# EAGLE design avr_route (EAGLE 5.07)
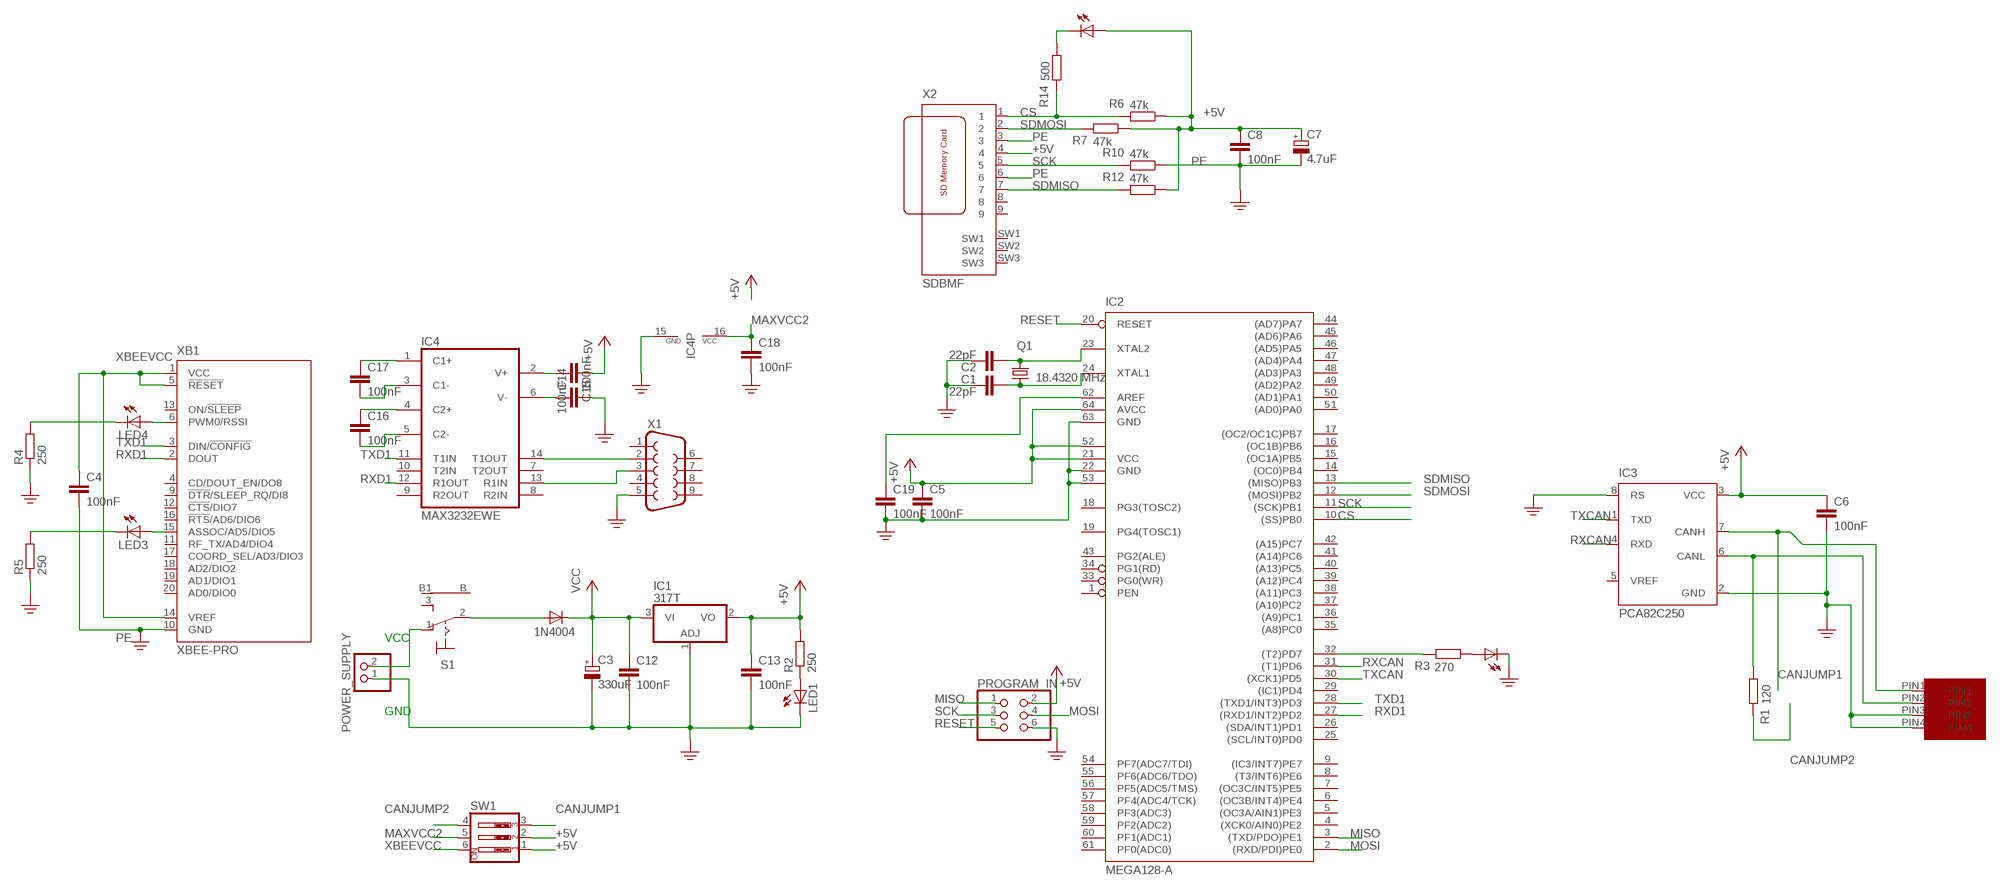
[diagram p0: schematic, sheet 1]

## Parts
C1  22pF  C5/2.5  [C5B2.5]
C2  22pF  C5/2.5  [C5B2.5]
C3  330uF  CPOL-EUE15-5AXIAL  [E15-5]
C4  100nF  C-EU050-024X044  [C050-024X044]
C5  100nF  C-EU050-024X044  [C050-024X044]
C6  100nF  C-EU050-024X044  [C050-024X044]
C7  4.7uF  CPOL-EUE15-5AXIAL  [E15-5]
C8  100nF  C-EU050-024X044  [C050-024X044]
C12  100nF  C-EU050-024X044  [C050-024X044]
C13  100nF  C-EU050-024X044  [C050-024X044]
C14  100nF  C-EU050-024X044  [C050-024X044]
C15  100nF  C-EU050-024X044  [C050-024X044]
C16  100nF  C-EU050-024X044  [C050-024X044]
C17  100nF  C-EU050-024X044  [C050-024X044]
C18  100nF  C-EU050-024X044  [C050-024X044]
C19  100nF  C-EU050-024X044  [C050-024X044]
D1  1N4004  [DO41-10]
IC1  317T  [TO220H]
IC2  MEGA128-A  [TQFP64]
IC3  PCA82C250  [DIL08]
IC4  MAX3232EWE  [SO16L]
LED1  LED5MM  [LED5MM]
LED2  LED5MM  [LED5MM]
LED3  LED5MM  [LED5MM]
LED4  LED5MM  [LED5MM]
LED5  LED5MM  [LED5MM]
POWER_SUPPLY  PINHD-1X2  [1X02]
PROGRAM_IN  PINHD-2X3  [2X03]
Q1  18.4320 MHz  CRYSTALHC49U70  [HC49U70]
R1  120  R-EU_0207/10  [0207/10]
R2  250  R-EU_0207/10  [0207/10]
R3  270  R-EU_0207/10  [0207/10]
R4  250  R-EU_0207/10  [0207/10]
R5  250  R-EU_0207/10  [0207/10]
R6  47k  R-EU_0207/10  [0207/10]
R7  47k  R-EU_0207/10  [0207/10]
R10  47k  R-EU_0207/10  [0207/10]
R12  47k  R-EU_0207/10  [0207/10]
R14  500  R-EU_0207/10  [0207/10]
S1  LPV-1  [LPV-1]
SW1  SW_DIP-3  [EDG-03]
U$1  MICROFIT4  [MICROFIT4SOCK]
X1  F09HP  [F09HP]
X2  SDBMF  [SDBMF-009XXBXX2]
XB1  XBEE-PRO  [XBEE-PRO]

## Nets
+5V: C5.1 C6.1 C7.+ C8.1 C13.1 C15.1 IC1.2(VO) IC2.21(VCC) IC2.52(VCC1) IC2.64(AVCC) IC3.3(VCC) LED5.A PROGRAM_IN.2 R2.2 R6.1 R7.1 R12.1 SW1.1 SW1.2 X2.4
CANJUMP1: IC3.7(CANH) SW1.3 U$1.PIN1
CANJUMP2: R1.2 SW1.4
CS: IC2.10((SS)PB0) R6.2 R14.2 X2.1
MAXVCC2: C18.1 IC4.16(VCC) SW1.5
MISO: IC2.3((TXD/PDO)PE1) PROGRAM_IN.1
MOSI: IC2.2((RXD/PDI)PE0) PROGRAM_IN.4
N$1: C1.2 IC2.24(XTAL1) Q1.1
N$2: C2.2 IC2.23(XTAL2) Q1.2
N$4: D1.A S1.2(P)
N$5: POWER_SUPPLY.2 S1.1(O)
N$6: LED1.A R2.1
N$8: LED2.A R3.1
N$10: C19.1 IC2.62(AREF)
N$21: IC4.13(R1IN) X1.3
N$33: IC4.14(T1OUT) X1.2
N$35: C17.1 IC4.1(C1+)
N$36: C17.2 IC4.3(C1-)
N$37: C16.1 IC4.4(C2+)
N$38: C16.2 IC4.5(C2-)
N$39: C14.1 IC4.6(V-)
N$41: C15.2 IC4.2(V+)
N$43: IC2.32((T2)PD7) R3.2
N$50: LED4.A XB1.6(PWM0/RSSI)
N$51: IC3.6(CANL) R1.1 U$1.PIN2
N$52: LED3.A XB1.15(ASSOC/AD5/DIO5)
N$57: LED4.K(C) R4.2
N$58: LED3.K(C) R5.2
N$59: LED5.K(C) R14.1
PE: C1.1 C2.1 C3.- C4.2 C5.2 C6.2 C7.- C8.2 C12.2 C13.2 C14.2 C18.2 C19.2 IC1.1(ADJ) IC2.22(GND) IC2.53(GND1) IC2.63(GND) IC3.2(GND) IC3.8(RS) IC4.15(GND) LED1.K(C) LED2.K(C) POWER_SUPPLY.1 PROGRAM_IN.6 R4.1 R5.1 R10.1 U$1.PIN3 U$1.PIN4 X1.5 X2.3 X2.6 XB1.10(GND)
RESET: IC2.20(RESET) PROGRAM_IN.5
RXCAN: IC2.31((T1)PD6) IC3.4(RXD)
RXD1: IC2.27((RXD1/INT2)PD2) IC4.12(R1OUT) XB1.2(DOUT)
SCK: IC2.11((SCK)PB1) PROGRAM_IN.3 R10.2 X2.5
SDMISO: IC2.13((MISO)PB3) R12.2 X2.7
SDMOSI: IC2.12((MOSI)PB2) R7.2 X2.2
TXCAN: IC2.30((XCK1)PD5) IC3.1(TXD)
TXD1: IC2.28((TXD1/INT3)PD3) IC4.11(T1IN) XB1.3(DIN/!CONFIG)
VCC: C3.+ C12.1 D1.C IC1.3(VI)
XBEEVCC: C4.1 SW1.6 XB1.1(VCC) XB1.5(!RESET) XB1.14(VREF)
Unconnected: IC2.1(PEN) IC2.4((XCK0/AIN0)PE2) IC2.5((OC3A/AIN1)PE3) IC2.6((OC3B/INT4)PE4) IC2.7((OC3C/INT5)PE5) IC2.8((T3/INT6)PE6) IC2.9((IC3/INT7)PE7) IC2.14((OC0)PB4) IC2.15((OC1A)PB5) IC2.16((OC1B)PB6) IC2.17((OC2/OC1C)PB7) IC2.18(PG3(TOSC2)) IC2.19(PG4(TOSC1)) IC2.25((SCL/INT0)PD0) IC2.26((SDA/INT1)PD1) IC2.29((IC1)PD4) IC2.33(PG0(WR)) IC2.34(PG1(RD)) IC2.35((A8)PC0) IC2.36((A9)PC1) IC2.37((A10)PC2) IC2.38((A11)PC3) IC2.39((A12)PC4) IC2.40((A13)PC5) IC2.41((A14)PC6) IC2.42((A15)PC7) IC2.43(PG2(ALE)) IC2.44((AD7)PA7) IC2.45((AD6)PA6) IC2.46((AD5)PA5) IC2.47((AD4)PA4) IC2.48((AD3)PA3) IC2.49((AD2)PA2) IC2.50((AD1)PA1) IC2.51((AD0)PA0) IC2.54(PF7(ADC7/TDI)) IC2.55(PF6(ADC6/TDO)) IC2.56(PF5(ADC5/TMS)) IC2.57(PF4(ADC4/TCK)) IC2.58(PF3(ADC3)) IC2.59(PF2(ADC2)) IC2.60(PF1(ADC1)) IC2.61(PF0(ADC0)) IC3.5(VREF) IC4.7(T2OUT) IC4.8(R2IN) IC4.9(R2OUT) IC4.10(T2IN) S1.3(S) S1.B S1.B1 X1.1 X1.4 X1.6 X1.7 X1.8 X1.9 X2.8 X2.9 X2.SW1 X2.SW2 X2.SW3 XB1.4(CD/DOUT_EN/DO8) XB1.9(!DTR!/SLEEP_RQ/DI8) XB1.11(RF_TX/AD4/DIO4) XB1.12(!CTS!/DIO7) XB1.13(ON/!SLEEP) XB1.16(!RTS!/AD6/DIO6) XB1.17(COORD_SEL/AD3/DIO3) XB1.18(AD2/DIO2) XB1.19(AD1/DIO1) XB1.20(AD0/DIO0)

## Notes on the sheet
- VCC
- GND

## Library data of the parts
C1 C2 = capacitor-wima:C: CAPACITOR naming: grid - package width
C3 C7 = rcl:CPOL-EU: POLARIZED CAPACITOR, European symbol
C4-C6 C8 C12-C19 = rcl:C-EU: CAPACITOR, European symbol
D1 = diode:1N4004: DIODE general purpose rectifier, 1 A
IC1 = linear:*317: Positive VOLTAGE REGULATOR
IC2 = atmel:MEGA128: MICROCONTROLLER 128 Kbytes FLASH 4 Kbytes SRAM 4 Kbytes EEPROM DUAL USART 8-channel 10 bit ADC Source: avr.lbr
IC3 = micro-philips:PCA82C250: CAN CONTROLLER INTERFACE
IC4 = maxim:MAX3232*: True RS-232 Transceivers 3.0V to 5.5V, Low-Power up to 1Mbps, Using Four 0.1µF External Capacitors Source: http://pdfserv.maxim-ic.com/en/ds/MAX3222-MAX3241.pdf
LED1-LED5 = led:LED: LED OSRAM: - CHIPLED LG R971, LG N971, LY N971, LG Q971, LY Q971, LO R971, LY R971 LH N974, LH R974 LS Q976, LO Q976, LY Q976 LO Q996 - Hyper CHIPLED LW Q18S LB Q993, LB Q99A, LB R99A - SideLED LS A670, LO A670, LY A670, LG A670, LP A670 LB A673, LV A673, LT A673, LW A673 LH A674 LY A675 LS A676, LA A676, LO A676, LY A676, LW A676 LS A679, LY A679, LG A679 - Hyper Micro SIDELED® LS Y876, LA Y876, LO Y876, LY Y876 LT Y87S - SmartLED LW L88C, LW L88S LB L89C, LB L89S, LG L890 LS L89K, LO L89K, LY L89K LS L896, LA L896, LO L896, LY L896 - TOPLED LS T670, LO T670, LY T670, LG T670, LP T670 LSG T670, LSP T670, LSY T670, LOP T670, LYG T670 LG T671, LOG T671, LSG T671 LB T673, LV T673, LT T673, LW T673 LH T674 LS T676, LA T676, LO T676, LY T676, LB T676, LH T676, LSB T676, LW T676 LB T67C, LV T67C, LT T67C, LS T67K, LO T67K, LY T67K, LW E67C LS E67B, LA E67B, LO E67B, LY E67B, LB E67C, LV E67C, LT E67C LW T67C LS T679, LY T679, LG T679 LS T770, LO T770, LY T770, LG T770, LP T770 LB T773, LV T773, LT T773, LW T773 LH T774 LS E675, LA E675, LY E675, LS T675 LS T776, LA T776, LO T776, LY T776, LB T776 LHGB T686 LT T68C, LB T68C - Hyper Mini TOPLED® LB M676 - Mini TOPLED Santana® LG M470 LS M47K, LO M47K, LY M47K Source: http://www.osram.convergy.de LUXEON: - LUMILED® LXK2-PW12-R00, LXK2-PW12-S00, LXK2-PW14-U00, LXK2-PW14-V00 LXK2-PM12-R00, LXK2-PM12-S00, LXK2-PM14-U00 LXK2-PE12-Q00, LXK2-PE12-R00, LXK2-PE12-S00, LXK2-PE14-T00, LXK2-PE14-U00 LXK2-PB12-K00, LXK2-PB12-L00, LXK2-PB12-M00, LXK2-PB14-N00, LXK2-PB14-P00, LXK2-PB14-Q00 LXK2-PR12-L00, LXK2-PR12-M00, LXK2-PR14-Q00, LXK2-PR14-R00 LXK2-PD12-Q00, LXK2-PD12-R00, LXK2-PD12-S00 LXK2-PH12-R00, LXK2-PH12-S00 LXK2-PL12-P00, LXK2-PL12-Q00, LXK2-PL12-R00 Source: www.luxeon.com KINGBRIGHT: KA-3528ASYC Source: www.kingbright.com
POWER_SUPPLY = pinhead:PINHD-1X2: PIN HEADER
PROGRAM_IN = pinhead:PINHD-2X3: PIN HEADER
Q1 = crystal:CRYSTAL: CRYSTAL
R1-R7 R10 R12 R14 = resistor:R-EU_: RESISTOR, European symbol
S1 = switch:LPV-1: TOGGLE SWITCH
SW1 = special:SW_DIP-3: DIP SWITCH
U$1 = UNICORN:MICROFIT4
X1 = con-subd:F09: SUB-D
X2 = farnell:SDBMF: SD MEMORY CARD PUSH-PUSH WITH CONNECTOR TYPE B (BIG SWUÌTCH #3) KINGFONT PRECISION INDUSTIAL CO., LTD Source: http://www.farnell.com/datasheets/74273.pdf Best.-Nr.: 9186174 Hersteller: MULTICOMP Herstellerbez.: SDBMF-00915B0T2
XB1 = maxstream:XBEE: XBee (TM) /XBee-PRO(TM) OEM RF Modules Source: MaxStream, Inc. xbee_productmanual.pdf

## Board
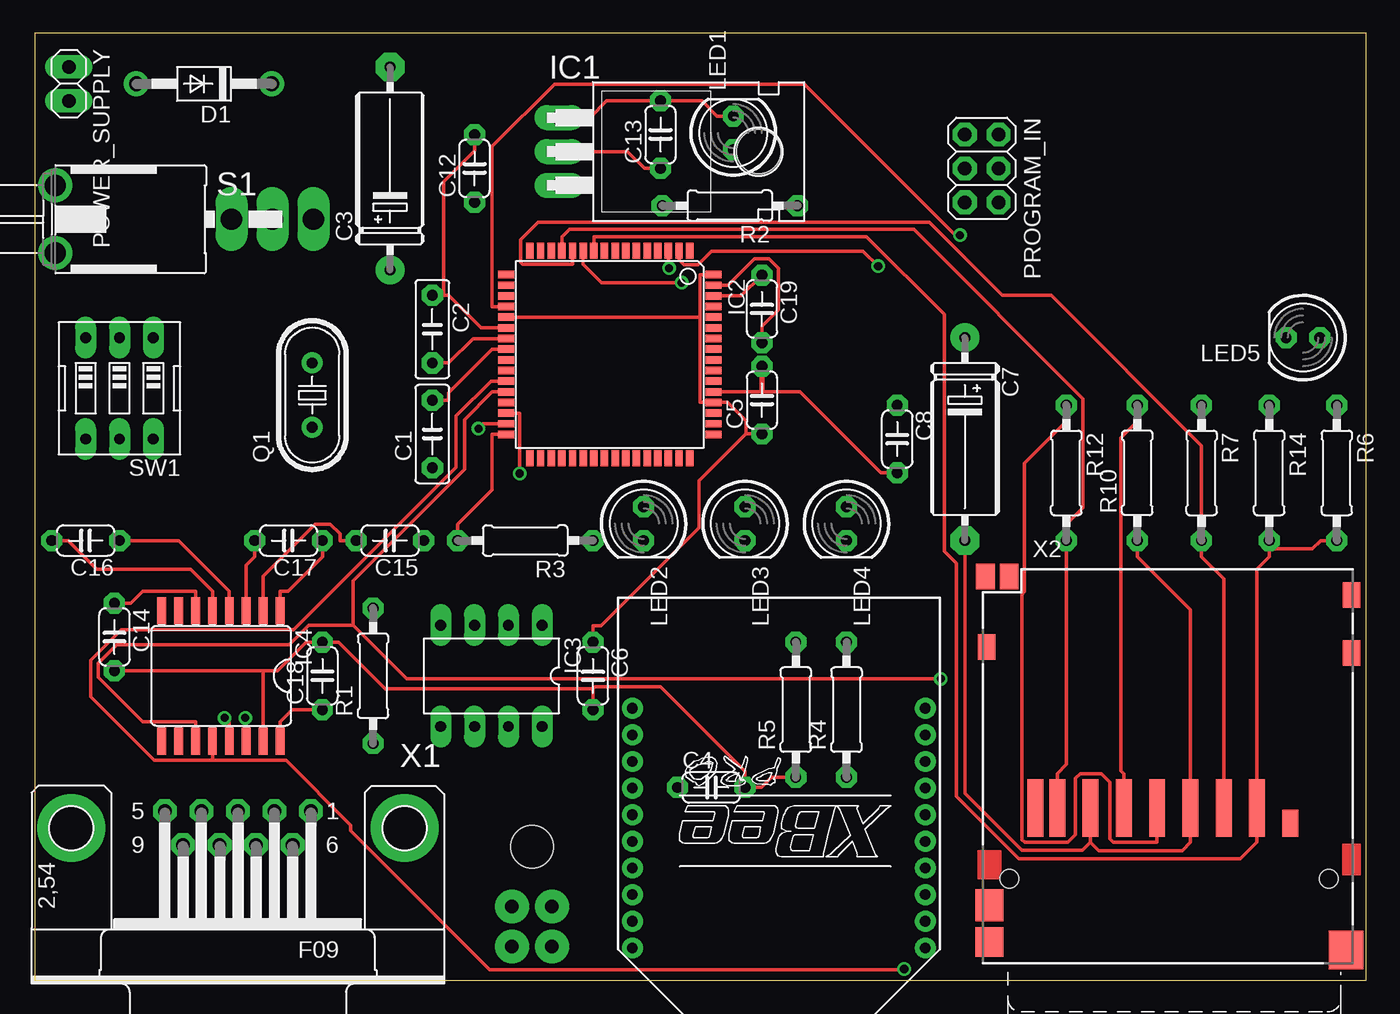
[diagram p1: board, top side]
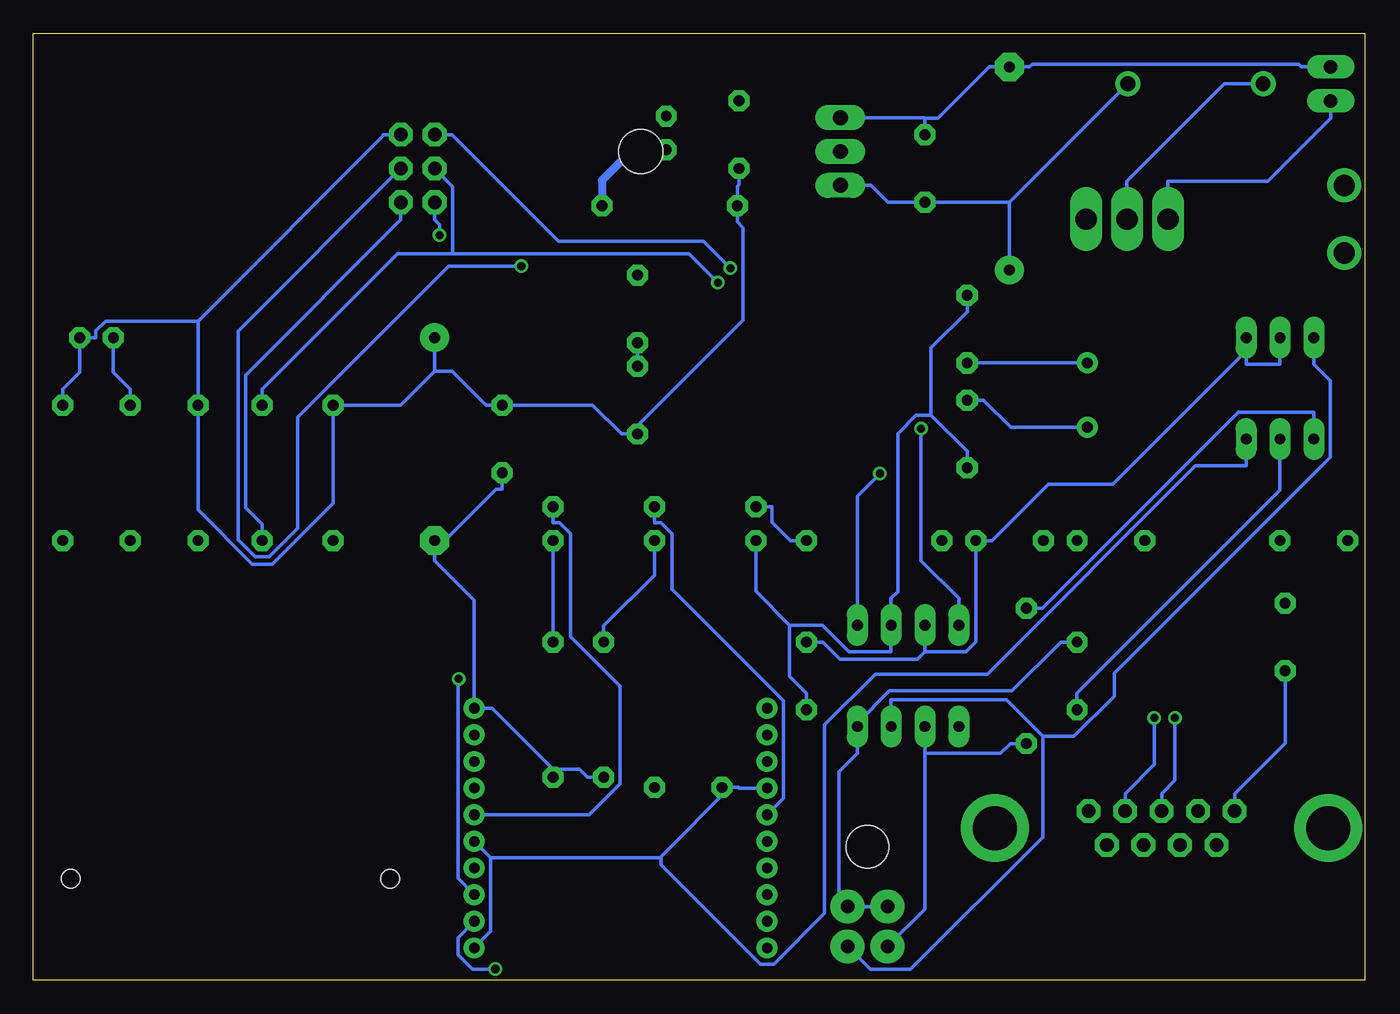
[diagram p2: board, bottom side, seen from below]

Size 100 x 71.11 mm. Coordinates in mm from the lower left corner, seen from the top.
Outline: 0,0 100,0 100,71.11 0,71.11 0,0
Copper layers (1*16): Top 0.035mm / dielectric 1.5mm / Bottom 0.035mm
Design rules "default *": minimum track width 10mil, minimum drill 24mil, track to track 12mil, track to pad 12mil, pad to pad 8mil, via to via 12mil, smd to smd 8mil, copper to edge 40mil, drill to drill 8mil, minimum pad ring 15mil, minimum via ring 8mil, stop-mask expansion 4mil, vias tented up to drill 0mil, thermal gap 10mil
tRestrict: area 43.2,1.3 to 45.7,21.6; area 66,1.3 to 68.6,21.6; area 29.2,25.4 to 39.4,27.9; area 29.2,17.8 to 39.4,20.3; area 35.4,1.9 to 39.2,7; area 34.3,1.3 to 40.6,6.3; area 2.5,47 to 10.2,49.5; area 2.5,39.4 to 10.2,41.9; area 59.7,31.8 to 62.2,36.8; area 52.1,31.8 to 54.6,35.6; area 52.1,35.6 to 54.6,36.8; area 92.7,47 to 97.8,49.5; 9 more areas

### Footprints (pad centres in the part's own frame; a part is rotated, then mirrored left to right if it is on the bottom)
C5B2.5 = drill 0.813 pad 1.6 octagon: 1 -2.54,0; 2 2.54,0
E15-5 = drill 0.813 pad 2.159 round: + -7.62,0 | drill 0.813 pad 2.159 octagon: - 7.62,0
C050-024X044 = drill 0.813 octagon: 1 -2.54,0; 2 2.54,0
DO41-10 = drill 1.118 round: A 5.08,0; C -5.08,0
TO220H = drill 1.118 long: 1 -2.54,-10.16; 2 0,-10.16; 3 2.54,-10.16 | hole 3.302: 0,4.826
TQFP64 = smd 1.194 x 0.559: 1 -7.8,6; 2 -7.8,5.2; 3 -7.8,4.4; 4 -7.8,3.6; 5 -7.8,2.8; 6 -7.8,2; 7 -7.8,1.2; 8 -7.8,0.4; 9 -7.8,-0.4; 10 -7.8,-1.2; 11 -7.8,-2; 12 -7.8,-2.8; 13 -7.8,-3.6; 14 -7.8,-4.4; 15 -7.8,-5.2; 16 -7.8,-6; 33 7.8,-6; 34 7.8,-5.2; 35 7.8,-4.4; 36 7.8,-3.6; 37 7.8,-2.8; 38 7.8,-2; 39 7.8,-1.2; 40 7.8,-0.4; 41 7.8,0.4; 42 7.8,1.2; 43 7.8,2; 44 7.8,2.8; 45 7.8,3.6; 46 7.8,4.4; 47 7.8,5.2; 48 7.8,6 | smd 0.559 x 1.194: 17 -6,-7.8; 18 -5.2,-7.8; 19 -4.4,-7.8; 20 -3.6,-7.8; 21 -2.8,-7.8; 22 -2,-7.8; 23 -1.2,-7.8; 24 -0.4,-7.8; 25 0.4,-7.8; 26 1.2,-7.8; 27 2,-7.8; 28 2.8,-7.8; 29 3.6,-7.8; 30 4.4,-7.8; 31 5.2,-7.8; 32 6,-7.8; 49 6,7.8; 50 5.2,7.8; 51 4.4,7.8; 52 3.6,7.8; 53 2.8,7.8; 54 2,7.8; 55 1.2,7.8; 56 0.4,7.8; 57 -0.4,7.8; 58 -1.2,7.8; 59 -2,7.8; 60 -2.8,7.8; 61 -3.6,7.8; 62 -4.4,7.8; 63 -5.2,7.8; 64 -6,7.8
DIL08 = drill 0.813 long: 1 -3.81,-3.81; 2 -1.27,-3.81; 3 1.27,-3.81; 4 3.81,-3.81; 5 3.81,3.81; 6 1.27,3.81; 7 -1.27,3.81; 8 -3.81,3.81
SO16L = smd 0.66 x 2.032: 1 -4.445,-4.902; 2 -3.175,-4.902; 3 -1.905,-4.902; 4 -0.635,-4.902; 5 0.635,-4.902; 6 1.905,-4.902; 7 3.175,-4.902; 8 4.445,-4.902; 9 4.445,4.902; 10 3.175,4.902; 11 1.905,4.902; 12 0.635,4.902; 13 -0.635,4.902; 14 -1.905,4.902; 15 -3.175,4.902; 16 -4.445,4.902
LED5MM = drill 0.813 octagon: A -1.27,0; K 1.27,0
1X02 = drill 1.016 long: 1 -1.27,0; 2 1.27,0
2X03 = drill 1.016 octagon: 1 -2.54,-1.27; 2 -2.54,1.27; 3 0,-1.27; 4 0,1.27; 5 2.54,-1.27; 6 2.54,1.27
HC49U70 = drill 0.813 round: 1 -2.413,0; 2 2.413,0
0207/10 = drill 0.813 octagon: 1 -5.08,0; 2 5.08,0
LPV-1 = drill 1.6 long: 1 0,13.24; 2 0,16.32; 3 0,19.4 | drill 1.6 pad 2.54 round: B -2.54,0; B1 2.54,0
EDG-03 = drill 0.813 long: 1 -2.54,-3.81; 2 0,-3.81; 3 2.54,-3.81; 4 2.54,3.81; 5 0,3.81; 6 -2.54,3.81
MICROFIT4SOCK = drill 1 pad 2.54 round: PIN1 -2,0; PIN2 1,0; PIN3 -2,-3; PIN4 1,-3 | hole 3.2: -0.5,-7.5
F09HP = drill 1.016 octagon: 1 -5.486,-1.27; 2 -2.743,-1.27; 3 0,-1.27; 4 2.743,-1.27; 5 5.486,-1.27; 6 -4.115,1.27; 7 -1.372,1.27; 8 1.372,1.27; 9 4.115,1.27 | drill 3.302 pad 5.08 round: G1 -12.522,0; G2 12.522,0
SDBMF-009XXBXX2 = smd 1.2 x 4.3: 1 6.7,5.325; 2 4.2,5.325; 3 1.7,5.325; 4 -0.8,5.325; 5 -3.3,5.325; 6 -5.8,5.325; 7 -8.3,5.325; 8 -9.925,5.325 | smd 1.2 x 2: 9 9.2,4.175 | smd 2.1 x 2.4: M1 -13.4,-2 | smd 2.6 x 2.9: M2 13.4,-5.35 | smd 1.3 x 1.9: M3 -13.6,17.4; M4 13.8,16.95; M5 13.8,21.3 | smd 1.4 x 1.95: SW1 -11.9,22.7; SW3 -13.7,22.7 | smd 2.1 x 2.2: SW2 -13.4,-4.75 | hole 1.4: -11.9,0; 12.1,0
XBEE-PRO = drill 0.8 pad 1.27 round: 1 -11,9; 2 -11,7; 3 -11,5; 4 -11,3; 5 -11,1; 6 -11,-1; 7 -11,-3; 8 -11,-5; 9 -11,-7; 10 -11,-9; 11 11,-9; 12 11,-7; 13 11,-5; 14 11,-3; 15 11,-1; 16 11,1; 17 11,3; 18 11,5; 19 11,7; 20 11,9

### Placement (x,y rotation side)
C1  29.84,41.02 90 top
C2  29.84,48.9 270 top
C3  26.67,60.96 90 top
C4  50.8,14.48 0 top
C5  54.61,43.56 90 top
C6  41.91,22.86 270 top
C7  69.85,40.64 270 top
C8  64.77,40.64 270 top
C12  33.02,60.96 90 top
C13  46.99,63.5 90 top
C14  5.97,25.78 270 top
C15  26.67,33.02 180 top
C16  3.81,33.02 180 top
C17  19.05,33.02 180 top
C18  21.59,22.86 90 top
C19  54.61,50.42 270 top
D1  12.7,67.31 180 top
IC1  49.53,62.23 270 top
IC2  43.18,46.99 270 top
IC3  34.29,22.86 180 top
IC4  13.97,22.86 180 top
LED1  52.45,63.63 90 top
LED2  45.72,34.29 270 top
LED3  53.34,34.29 270 top
LED4  60.96,34.29 270 top
LED5  95.25,48.26 180 top
POWER_SUPPLY  2.54,67.31 270 top
PROGRAM_IN  71.12,60.96 270 top
Q1  20.83,43.94 90 top
R1  25.4,22.86 90 top
R2  52.2,58.17 180 top
R3  36.83,33.02 180 top
R4  60.96,20.32 90 top
R5  57.15,20.32 90 top
R6  97.79,38.1 270 top
R7  87.63,38.1 270 top
R10  82.8,38.1 90 top
R12  77.47,38.1 270 top
R14  92.71,38.1 270 top
S1  1.52,57.15 270 top
SW1  6.35,44.45 180 top
U$1  36.83,2.54 180 top
X1  15.24,11.43 180 top
X2  85.09,7.62 0 top
XB1  55.88,11.43 180 top

### Tracks (layer width: path | path; a pad name or v marks a point on that pad's centre or on a via)
+5V
  Top 0.254: R12.1 77.47,41.96 74.34,38.83 74.34,29.17 74.13,28.96 74.13,10.56 74.35,10.35 77.58,10.35 78.15,10.92 78.15,15.17 78.51,15.53 80.1,15.53 80.76,14.87 80.76,10.62 81.01,10.36 84.29,10.36 X2.4 | C6.1 41.91,26.62 42.52,26.62 49.89,33.99 49.89,37.52 53.39,41.02 | 53.39,41.02 C5.1 | 53.39,41.02 53.39,42.01 52.01,43.39 IC2.52 49.95,43.39 49.95,49.79 | C13.1 45.77,60.96 44.5,62.23 IC1.2 | 49.95,49.79 49.95,52.99 IC2.64 | 49.95,49.79 IC2.21
  Bottom 0.254: 55.22,41.02 46.69,49.55 46.69,56.52 47.12,56.95 R2.2 47.12,59.61 46.99,59.74 C13.1 | 33.02,24.66 33.58,24.1 39.4,24.1 40.69,25.4 C6.1 | PROGRAM_IN.2 73.71,63.5 73.71,63.41 87.63,49.49 | 87.63,49.49 R7.1 87.63,35.32 83.55,31.24 82.07,31.24 77.47,35.84 R12.1 72.39,43.18 69.85,45.72 | 87.63,49.49 94.58,49.49 95.3,48.77 95.3,48.26 LED5.A 96.52,45.67 97.79,44.4 R6.1 | 69.85,45.72 68.53,45.72 65.99,43.18 C8.1 57.99,43.18 55.83,41.02 55.22,41.02 | 69.85,45.72 C7.+ | C5.1 55.22,41.02 | 33.02,24.66 29.95,24.66 29.21,25.4 C15.1 27.99,33.02 23.76,37.25 18.9,37.25 8.89,47.26 | 33.02,24.66 33.02,24.8 IC3.3 | 8.89,47.26 8.89,46.25 6.35,46.25 SW1.2 | 8.89,47.26 SW1.1
CANJUMP1
  Bottom 0.254: SW1.3 3.81,46.25 2.59,45.03 2.59,39.27 18.8,23.05 18.8,21.35 21.83,18.32 24.18,18.32 | 24.18,18.32 26.91,21.06 35.56,21.06 IC3.7 | U$1.PIN1 37.12,0.83 34.11,0.83 24.18,10.76 24.18,18.32
CANJUMP2
  Bottom 0.254: R1.2 24.18,27.94 9.47,42.65 3.81,42.65 SW1.4
CS
  Top 0.254: IC2.10 41.98,55.82 62.47,55.82 68.3,49.99 68.3,32.22 69.22,31.31 69.22,13.81 73.9,9.12 90.55,9.12 91.79,10.36 X2.1 91.79,30.88 92.71,31.8 92.71,32.41 | R6.2 96.57,33.02 95.96,32.41 92.71,32.41 | 92.71,32.41 R14.2
MAXVCC2
  Top 0.254: IC4.16 18.41,19.41 19.33,20.32 20.37,20.32 C18.1
  Bottom 0.254: C18.1 21.59,21.54 6.35,36.78 SW1.5
MISO  (via drill 0.61 pad 1.02)
  Top 0.254: IC2.3 47.58,53.52 v47.63,53.47
  Bottom 0.254: v47.63,53.47 49.66,55.51 60.53,55.51 68.53,63.5 PROGRAM_IN.1
MOSI  (via drill 0.61 pad 1.02)
  Top 0.254: v63.34,53.62 62.21,54.75 50.82,54.75 49.8,53.73 48.75,53.73 48.38,54.1 IC2.2
  Bottom 0.254: PROGRAM_IN.4 84.62,48.73 84.62,33.09 83.32,31.8 82.3,31.8 80.14,33.96 80.14,42.28 68.79,53.62 v63.34,53.62
N$1
  Top 0.254: IC2.24 34.35,47.39 31.08,44.12 31.08,43.56 C1.2
  Bottom 0.254: C1.2 28.61,43.56 26.58,41.53 Q1.1
N$2
  Top 0.254: C2.2 31.08,46.35 32.91,48.19 IC2.23
  Bottom 0.254: Q1.2 C2.2
N$4
  Bottom 0.254: S1.2 17.84,59.98 10.52,67.31 D1.A
N$5
  Bottom 0.254: POWER_SUPPLY.2 2.54,64.72 7.28,59.98 14.76,59.98 S1.1
N$6
  Bottom 0.61: LED1.A 54.99,62.36 57.28,60.07 R2.1
N$8
  Bottom 0.254: LED2.A 44.5,35.56 44.5,34.39 43.13,33.02 R3.1
N$10
  Top 0.254: C19.1 53.04,51.39 IC2.62
N$21  (via drill 0.61 pad 1.02)
  Top 0.254: IC4.13 14.61,19.41 14.53,19.41 v14.24,19.7
  Bottom 0.254: X1.3 15.24,14.02 14.24,15.02 v14.24,19.7
N$33  (via drill 0.61 pad 1.02)
  Top 0.254: IC4.14 15.88,19.62 v15.79,19.7
  Bottom 0.254: v15.79,19.7 15.79,16.21 17.98,14.02 X1.2
N$35
  Top 0.254: IC4.1 18.41,29.21 19,29.21 21.59,31.8 C17.1
N$36
  Top 0.254: C17.2 16.51,31.8 15.88,31.17 IC4.3
N$37
  Top 0.254: IC4.4 14.61,29.21 10.79,33.02 C16.1
N$38
  Top 0.254: C16.2 2.49,33.02 4.65,30.86 11.68,30.86 13.34,29.21 IC4.5
N$39
  Top 0.254: C14.1 7.19,28.32 8.08,29.21 12.06,29.21 IC4.6
N$41
  Top 0.254: C15.2 22.91,33.02 22.91,33.52 22.19,34.25 21.04,34.25 17.14,30.36 IC4.2
N$43
  Top 0.254: IC2.32 34.35,40.99 34.35,36.84 31.75,34.24 R3.2
N$50
  Bottom 0.254: LED4.A 60.96,34.34 60.45,34.34 59.64,33.52 59.64,25.8 55.92,22.09 55.92,14.74 58.24,12.43 XB1.6
N$51
  Bottom 0.254: U$1.PIN2 33.02,5.35 33.02,17.04 | R1.1 26.62,17.78 27.36,17.04 33.02,17.04 | 33.02,17.04 IC3.6
N$52
  Bottom 0.254: LED3.A 53.34,34.34 52.84,34.34 52.02,33.52 52.02,29.34 43.66,20.98 43.66,13.65 XB1.15
N$57
  Bottom 0.254: R4.2 LED4.K
N$58
  Bottom 0.254: R5.2 57.15,26.62 53.34,30.43 LED3.K
N$59
  Bottom 0.254: R14.1 92.71,44.4 93.98,45.67 LED5.K
PE
  Top 0.254: 41.91,21.89 26.32,21.89 22.81,25.4 C18.2 20.37,25.4 18.21,23.24 17.14,23.24 | 41.91,21.89 42.06,22.04 47,22.04 53.34,15.7 C4.2 54.56,14.48 55.32,15.24 R5.1 | 41.91,21.89 41.91,21.54 C6.2 | C14.2 17.14,23.24 | 17.14,23.24 17.14,19.41 IC4.15 | C12.2 33.02,62.28 30.7,59.96 30.7,51.44 | 30.7,51.44 31.08,51.44 33.52,48.99 IC2.22 | C2.1 30.7,51.44 | LED1.K 51.23,64.9 50.09,66.04 C13.2 42.95,66.04 41.68,64.77 IC1.1 | 79.29,10.36 79.91,9.74 86.17,9.74 86.79,10.36 X2.3 86.79,27.82 82.8,31.8 R10.1 | C7.- 69.85,14.03 74.13,9.76 78.68,9.76 79.29,10.36 | 79.29,10.36 X2.6 | C19.2 54.61,49.1 55.86,50.35 55.86,53.46 55.12,54.2 54.06,54.2 52.05,52.19 IC2.63 | IC2.53 54.61,44.19 57.46,44.19 63.55,38.1 C8.2
  Top 0.406: 54.61,44.19 54.61,44.81 C5.2
  Bottom 0.254: C18.2 22.81,25.4 26.48,21.73 35.69,21.73 38.1,19.32 IC3.8 38.1,17.04 39.48,15.66 39.48,6.19 U$1.PIN3 U$1.PIN4 | 43.19,26.67 45.72,29.2 45.72,31.8 LED2.K | 43.19,26.67 40.73,26.67 38.72,24.66 35.56,24.66 IC3.2 35.56,28.68 35.05,29.18 35.05,41.05 33.68,42.43 32.56,42.43 | 43.19,26.67 43.19,22.82 41.91,21.54 C6.2 | 32.56,42.43 29.84,39.71 C1.1 | 32.56,42.43 32.56,47.49 29.84,50.2 C2.1 | 60.96,15.85 65.54,20.43 XB1.10 66.88,28.54 69.85,31.51 69.85,32.26 | R5.1 58.37,15.24 58.98,15.85 60.96,15.85 | 60.96,15.85 R4.1 | C8.2 64.77,36.88 65.23,36.88 69.85,32.26 | 69.85,32.26 C7.- | C5.2 C19.2 | IC1.1 33.07,64.77 33.02,64.72 | C12.2 33.02,64.72 | 33.02,64.72 32.04,64.72 28.18,68.58 C3.- 25.16,68.58 24.96,68.77 4.94,68.77 4.75,68.58 POWER_SUPPLY.1 | PROGRAM_IN.6 72.39,57.1 84.06,45.43 84.06,35.49 82.8,34.24 R10.1 | X1.5 9.75,14.02 5.97,17.8 C14.2
RESET  (via drill 0.61 pad 1.02)
  Top 0.254: IC2.20 34.35,50.59 34.35,62.63 39.02,67.3 57.78,67.3 69.12,55.96 v69.49,55.96
  Bottom 0.254: PROGRAM_IN.5 69.85,57.1 69.49,56.74 v69.49,55.96
RXCAN  (via drill 0.61 pad 1.02)
  Top 0.254: v33.31,41.42 33.68,41.79 IC2.31
  Bottom 0.254: IC3.4 30.48,28.68 33.31,31.51 v33.31,41.42
RXD1  (via drill 0.61 pad 1.02)
  Top 0.254: 13.34,16.51 8.95,16.51 4.17,21.29 4.17,24.02 6.47,26.31 19.43,26.31 31.64,38.52 31.64,42.38 34.25,44.99 IC2.27 | v65.3,0.84 65.25,0.8 34.14,0.8 23.71,11.22 23.71,11.66 18.86,16.51 13.34,16.51 | 13.34,16.51 IC4.12
  Bottom 0.254: XB1.2 68.1,3.21 68.1,1.93 67.02,0.84 v65.3,0.84
SCK  (via drill 0.61 pad 1.02)
  Top 0.254: v48.58,52.38 42.56,52.38 41.18,53.76 IC2.11 | R10.2 82.8,41.96 81.58,40.74 81.58,15.73 81.79,15.53 X2.5
  Bottom 0.254: 68.49,54.56 50.76,54.56 v48.58,52.38 | 68.49,54.56 72.64,54.56 82.8,44.4 R10.2 | 68.49,54.56 68.49,59.6 PROGRAM_IN.3
SDMISO
  Top 0.254: X2.7 76.79,15.53 77.47,16.21 R12.2 77.47,34.24 78.72,35.49 78.72,43.67 66.02,56.38 40.14,56.38 39.58,55.82 IC2.13
SDMOSI
  Top 0.254: X2.2 89.29,30.14 87.63,31.8 R7.2 87.63,40.15 76.34,51.44 72.68,51.44 67.19,56.94 37.8,56.94 36.47,55.6 36.47,53.93 36.63,53.76 40.38,53.76 IC2.12
TXCAN  (via drill 0.61 pad 1.02)
  Top 0.254: v36.41,38.05 36.41,42.59 IC2.30
  Bottom 0.254: v36.41,38.05 38.1,36.36 38.1,28.68 IC3.1
TXD1  (via drill 0.61 pad 1.02)
  Top 0.254: 23.89,26.66 20.57,26.66 19.1,25.2 6.14,25.2 4.74,23.8 4.74,22.74 8.08,19.41 12.06,19.41 IC4.11 | v68.05,22.63 27.92,22.63 23.89,26.66 | 23.89,26.66 23.89,29.99 32.27,38.36 32.27,42.11 34.35,44.19 IC2.28
  Bottom 0.254: XB1.3 68.09,7.64 68.09,22.58 v68.05,22.63
VCC
  Bottom 0.254: IC1.3 37.06,59.69 35.79,58.42 C12.1 26.67,58.42 | C3.+ 26.67,58.42 | 26.67,58.42 D1.C
XBEEVCC
  Bottom 0.254: 52.85,9.18 52.85,8.69 45.38,1.22 44.36,1.22 40.55,5.02 40.55,19.18 36.73,23 28.33,23 12.7,38.63 8.89,38.63 SW1.6 | 47.65,14.48 52.85,9.27 52.85,9.18 | 52.85,9.18 65.63,9.18 | 65.63,9.18 65.63,3.68 XB1.1 | 65.63,9.18 XB1.5 | 47.65,14.48 47.04,14.48 46.99,14.43 XB1.14 | 47.65,14.48 C4.1